# EAGLE schematic etherbotix_revB (EAGLE 7.1.0)
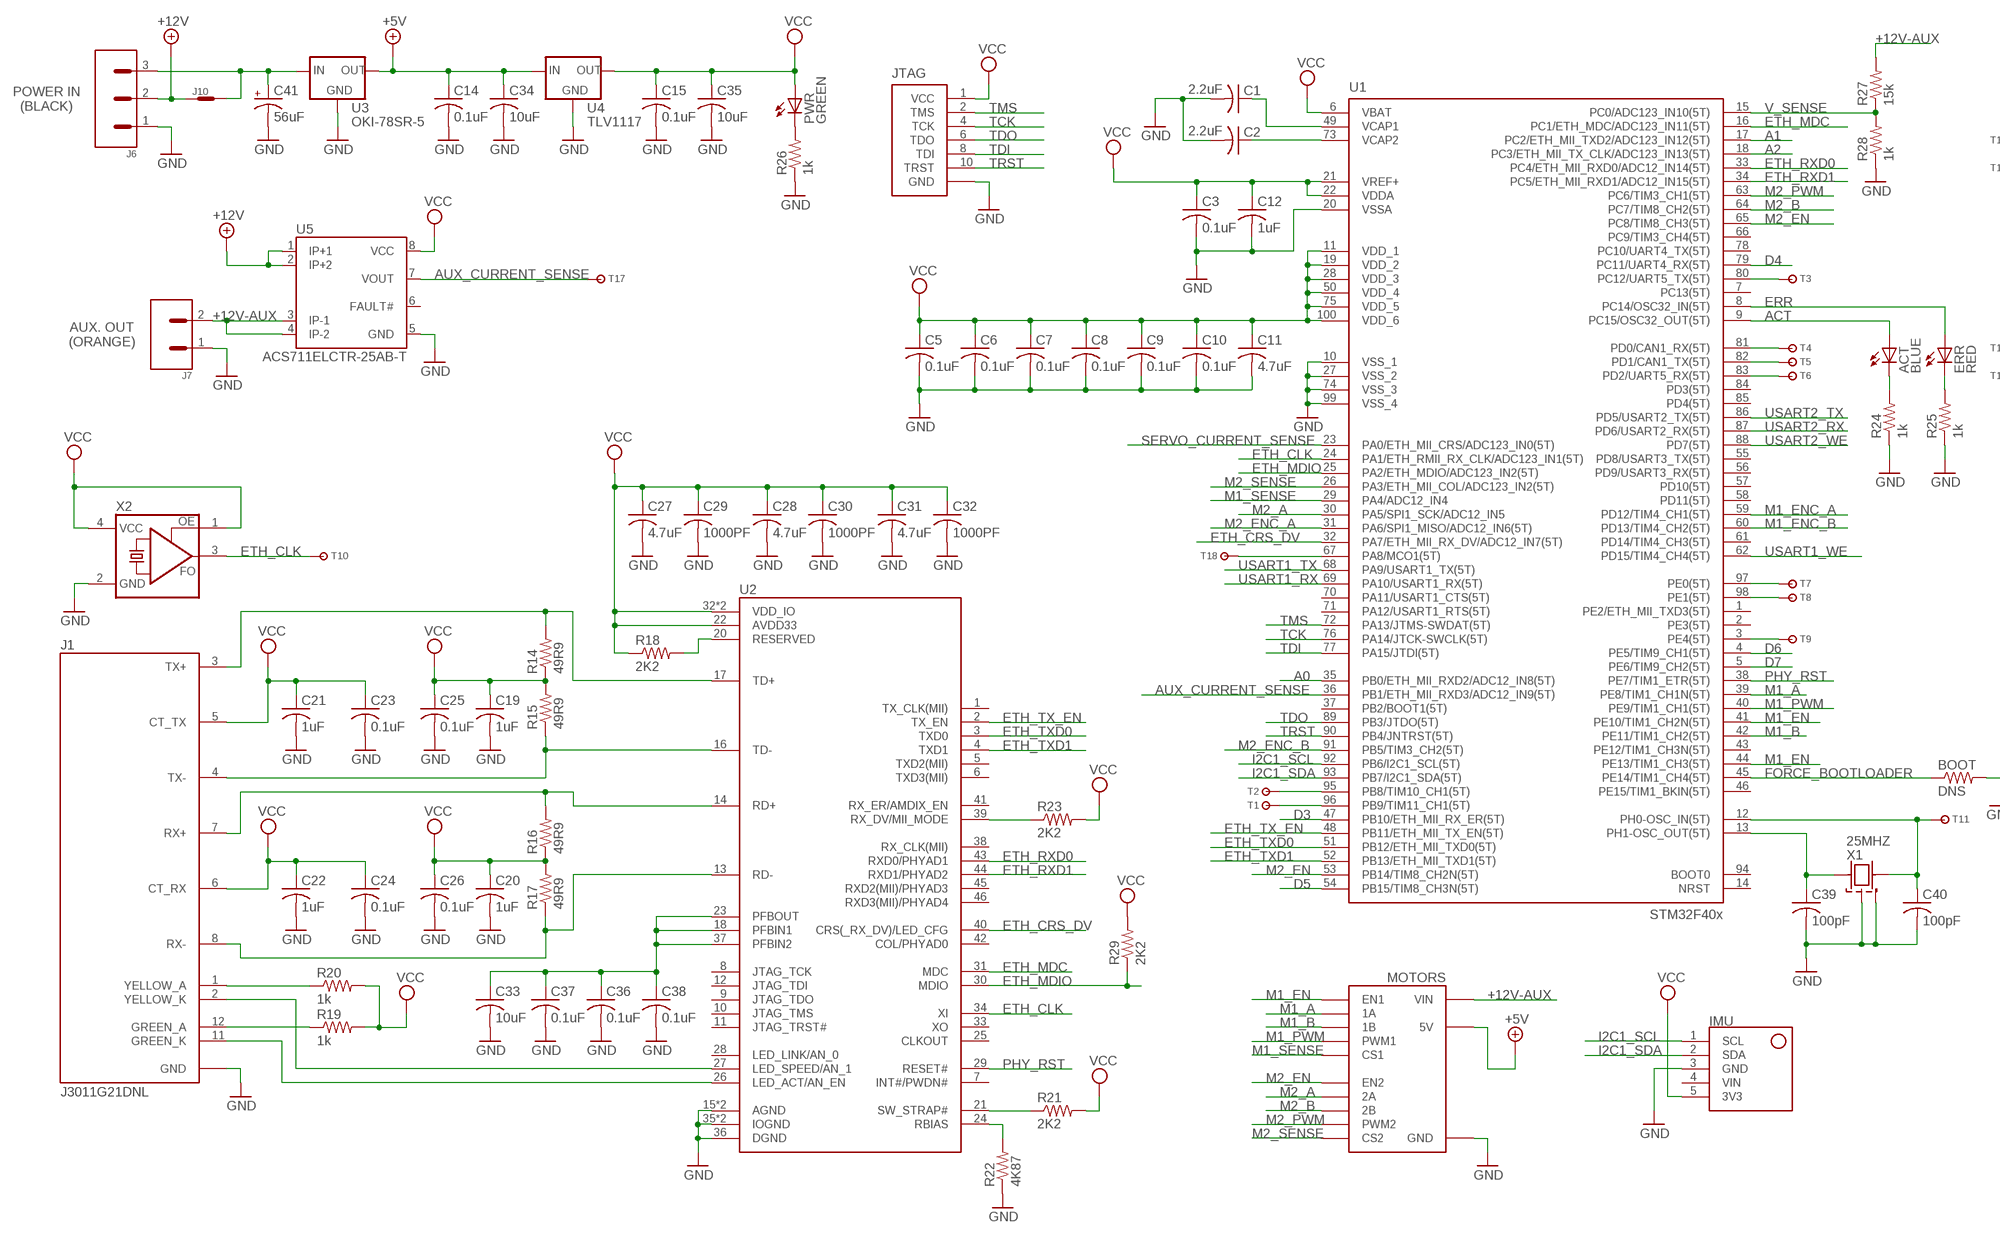
[diagram p0: schematic, sheet 1, part 1 of 2]
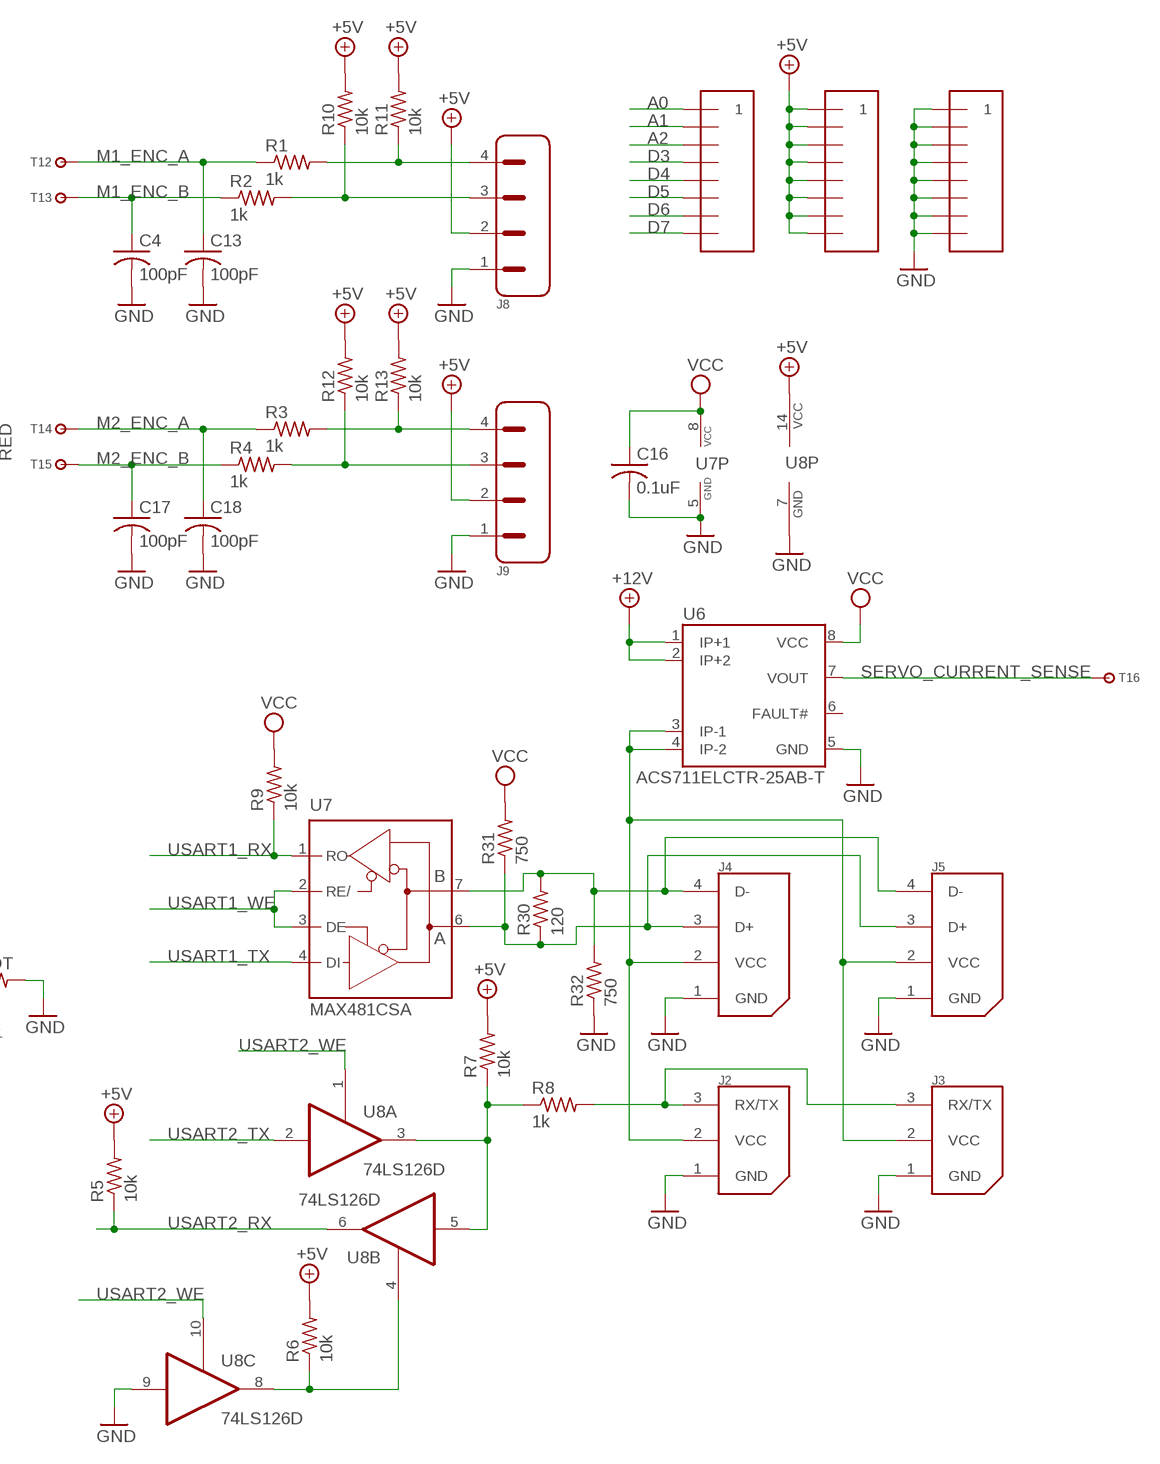
[diagram p1: schematic, sheet 1, part 2 of 2]

## Parts
ACT  BLUE  APT1608SGC  [LED0603]
BOOT  DNS  P1.00KHCT-ND  [0603]
C1  2.2uF  C1608X5R1C225K  [C0603]
C2  2.2uF  C1608X5R1C225K  [C0603]
C3  0.1uF  C1608X7R1H104K  [C0603]
C4  100pF  C1608C0G1H101J  [C0603]
C5  0.1uF  C1608X7R1H104K  [C0603]
C6  0.1uF  C1608X7R1H104K  [C0603]
C7  0.1uF  C1608X7R1H104K  [C0603]
C8  0.1uF  C1608X7R1H104K  [C0603]
C9  0.1uF  C1608X7R1H104K  [C0603]
C10  0.1uF  C1608X7R1H104K  [C0603]
C11  4.7uF  C1608X5R0J475K  [0603]
C12  1uF  C1608X5R1H105M  [C0603]
C13  100pF  C1608C0G1H101J  [C0603]
C14  0.1uF  C1608X7R1H104K  [C0603]
C15  0.1uF  C1608X7R1H104K  [C0603]
C16  0.1uF  C1608X7R1H104K  [C0603]
C17  100pF  C1608C0G1H101J  [C0603]
C18  100pF  C1608C0G1H101J  [C0603]
C19  1uF  C1608X5R1H105M  [C0603]
C20  1uF  C1608X5R1H105M  [C0603]
C21  1uF  C1608X5R1H105M  [C0603]
C22  1uF  C1608X5R1H105M  [C0603]
C23  0.1uF  C1608X7R1H104K  [C0603]
C24  0.1uF  C1608X7R1H104K  [C0603]
C25  0.1uF  C1608X7R1H104K  [C0603]
C26  0.1uF  C1608X7R1H104K  [C0603]
C27  4.7uF  C1608X5R0J475K  [0603]
C28  4.7uF  C1608X5R0J475K  [0603]
C29  1000PF  C1608X7R1H102K  [0603]
C30  1000PF  C1608X7R1H102K  [0603]
C31  4.7uF  C1608X5R0J475K  [0603]
C32  1000PF  C1608X7R1H102K  [0603]
C33  10uF  C1608X5R0J106M  [C0603]
C34  10uF  C1608X5R0J106M  [C0603]
C35  10uF  C1608X5R0J106M  [C0603]
C36  0.1uF  C1608X7R1H104K  [C0603]
C37  0.1uF  C1608X7R1H104K  [C0603]
C38  0.1uF  C1608X7R1H104K  [C0603]
C39  100pF  C1608C0G1H101J  [C0603]
C40  100pF  C1608C0G1H101J  [C0603]
C41  56uF  25SVPF56M  [OSCON_SVPF_6.3MM]
ERR  RED  APT1608SGC  [LED0603]
IMU  MINI9IMU  [MINI9IMU]
J1  J3011G21DNL  [J3]
J2  22-03-5035  [5267-3]
J3  22-03-5035  [5267-3]
J4  22-03-5045  [5267-4]
J5  22-03-5045  [5267-4]
J6  1760520000  [1760520000]
J7  1760490000  [1760490000]
J8  502443-0470  [502443-0470]
J9  502443-0470  [502443-0470]
J10  JUMPER  [J2]
JTAG  CORTEX_DEBUG-SHROUDED  [3220-10-0300-00]
MOTORS  MD03A  [MD03A]
PWR  GREEN  APT1608SGC  [LED0603]
R1  1k  P1.00KHCT-ND  [0603]
R2  1k  P1.00KHCT-ND  [0603]
R3  1k  P1.00KHCT-ND  [0603]
R4  1k  P1.00KHCT-ND  [0603]
R5  10k  P10.0KHCT-ND  [0603]
R6  10k  P10.0KHCT-ND  [0603]
R7  10k  P10.0KHCT-ND  [0603]
R8  1k  P1.00KHCT-ND  [0603]
R9  10k  P10.0KHCT-ND  [0603]
R10  10k  P10.0KHCT-ND  [0603]
R11  10k  P10.0KHCT-ND  [0603]
R12  10k  P10.0KHCT-ND  [0603]
R13  10k  P10.0KHCT-ND  [0603]
R14  49R9  P49.9HCT-ND  [0603]
R15  49R9  P49.9HCT-ND  [0603]
R16  49R9  P49.9HCT-ND  [0603]
R17  49R9  P49.9HCT-ND  [0603]
R18  2K2  P2.20KHCT-ND  [0603]
R19  1k  P1.00KHCT-ND  [0603]
R20  1k  P1.00KHCT-ND  [0603]
R21  2K2  P2.20KHCT-ND  [0603]
R22  4K87  P4.87KHCT-ND  [0603]
R23  2K2  P2.20KHCT-ND  [0603]
R24  1k  P1.00KHCT-ND  [0603]
R25  1k  P1.00KHCT-ND  [0603]
R26  1k  P1.00KHCT-ND  [0603]
R27  15k  P15.0KHCT-ND  [0603]
R28  1k  P1.00KHCT-ND  [0603]
R29  2K2  P2.20KHCT-ND  [0603]
R30  120  P120HCT-ND  [0603]
R31  750  P750HCT-ND  [0603]
R32  750  P750HCT-ND  [0603]
T1  TESTPAD  [TEST]
T2  TESTPAD  [TEST]
T3  TESTPAD  [TEST]
T4  TESTPAD  [TEST]
T5  TESTPAD  [TEST]
T6  TESTPAD  [TEST]
T7  TESTPAD  [TEST]
T8  TESTPAD  [TEST]
T9  TESTPAD  [TEST]
T10  TESTPAD  [TEST]
T11  TESTPAD  [TEST]
T12  TESTPAD  [TEST]
T13  TESTPAD  [TEST]
T14  TESTPAD  [TEST]
T15  TESTPAD  [TEST]
T16  TESTPAD  [TEST]
T17  TESTPAD  [TEST]
T18  TESTPAD  [TEST]
U1  STM32F407V  [TQFP100]
U2  TLK110  [LQFP48]
U3  OKI-78SR-5  OKI-78SR-5/1.5-W36-C  [OKI-78SR]
U4  TLV1117  TLV1117-33IKVURG3KVU  [DPAK]
U5  ACS711ELCTR-25AB-T  [SOIC8]
U6  ACS711ELCTR-25AB-T  [SOIC8]
U7  MAX481CSA  [SO08]
U8  74LS126D  [SO14]
U$1  HEADER8  [1X8]
U$2  HEADER8  [1X8]
U$3  HEADER8  [1X8]
X1  25MHZ  ABM3B-25.000MHZ-B2-T  [4LCC]
X2  ASEMB-50.000MHZ-XY-T  [OSCILLATOR]

## Nets
+5V: C14.1 C34.1 J8.2 J9.2 MOTORS.5V R5.2 R6.2 R7.2 R10.2 R11.2 R12.2 R13.2 U3.P$3(OUT) U4.3(IN) U8.14(P:VCC) U$2.P$1 U$2.P$2 U$2.P$3 U$2.P$4 U$2.P$5 U$2.P$6 U$2.P$7 U$2.P$8
+12V: J6.2 J10.A U5.1(IP+1) U5.2(IP+2) U6.1(IP+1) U6.2(IP+2)
+12V-AUX: J7.2 MOTORS.VIN1(VIN) MOTORS.VIN2(VIN) R27.2 U5.3(IP-1) U5.4(IP-2)
A0: U1.35(PB0/ETH_MII_RXD2/ADC12_IN8(5T)) U$1.P$1
A1: U1.17(PC2/ETH_MII_TXD2/ADC123_IN12(5T)) U$1.P$2
A2: U1.18(PC3/ETH_MII_TX_CLK/ADC123_IN13(5T)) U$1.P$3
ACT: ACT.A U1.9(PC15/OSC32_OUT(5T))
AUX_CURRENT_SENSE: T17.T U1.36(PB1/ETH_MII_RXD3/ADC12_IN9(5T)) U5.7(VOUT)
D3: U1.47(PB10/ETH_MII_RX_ER(5T)) U$1.P$4
D4: U1.79(PC11/UART4_RX(5T)) U$1.P$5
D5: U1.54(PB15/TIM8_CH3N(5T)) U$1.P$6
D6: U1.4(PE5/TIM9_CH1(5T)) U$1.P$7
D7: U1.5(PE6/TIM9_CH2(5T)) U$1.P$8
ERR: ERR.A U1.8(PC14/OSC32_IN(5T))
ETH_CLK: T10.T U1.24(PA1/ETH_RMII_RX_CLK/ADC123_IN1(5T)) U2.34(XI) X2.3(FO)
ETH_CRS_DV: U1.32(PA7/ETH_MII_RX_DV/ADC12_IN7(5T)) U2.40(CRS(_RX_DV)/LED_CFG)
ETH_MDC: U1.16(PC1/ETH_MDC/ADC123_IN11(5T)) U2.31(MDC)
ETH_MDIO: R29.1 U1.25(PA2/ETH_MDIO/ADC123_IN2(5T)) U2.30(MDIO)
ETH_RXD0: U1.33(PC4/ETH_MII_RXD0/ADC12_IN14(5T)) U2.43(RXD0/PHYAD1)
ETH_RXD1: U1.34(PC5/ETH_MII_RXD1/ADC12_IN15(5T)) U2.44(RXD1/PHYAD2)
ETH_TX_EN: U1.48(PB11/ETH_MII_TX_EN(5T)) U2.2(TX_EN)
ETH_TXD0: U1.51(PB12/ETH_MII_TXD0(5T)) U2.3(TXD0)
ETH_TXD1: U1.52(PB13/ETH_MII_TXD1(5T)) U2.4(TXD1)
FORCE_BOOTLOADER: BOOT.1 U1.45(PE14/TIM1_CH4(5T))
GND: BOOT.2 C1.2 C2.2 C3.2 C4.2 C5.2 C6.2 C7.2 C8.2 C9.2 C10.2 C11.2 C12.2 C13.2 C14.2 C15.2 C16.2 C17.2 C18.2 C19.2 C20.2 C21.2 C22.2 C23.2 C24.2 C25.2 C26.2 C27.2 C28.2 C29.2 C30.2 C31.2 C32.2 C33.2 C34.2 C35.2 C36.2 C37.2 C38.2 C39.2 C40.2 C41.- IMU.3(GND) J1.9(GND) J1.10(GND) J1.A(GND) J1.B(GND) J2.1(GND) J3.1(GND) J4.1(GND) J5.1(GND) J6.1 J7.1 J8.1 J9.1 JTAG.3(GND) JTAG.5(GND) JTAG.9(GND) MOTORS.GND1(GND) MOTORS.GND2(GND) R22.1 R24.1 R25.1 R26.1 R28.1 R32.1 U1.10(VSS_1) U1.20(VSSA) U1.27(VSS_2) U1.74(VSS_3) U1.99(VSS_4) U2.15(AGND) U2.19(AGND) U2.35(IOGND) U2.36(DGND) U2.47(IOGND) U3.P$2(GND) U4.1(GND) U5.5(GND) U6.5(GND) U7.5(GND) U8.7(P:GND) U8.9(C:I) U$3.P$1 U$3.P$2 U$3.P$3 U$3.P$4 U$3.P$5 U$3.P$6 U$3.P$7 U$3.P$8 X1.2(G1) X1.4(G2) X2.2(GND)
I2C1_SCL: IMU.1(SCL) U1.92(PB6/I2C1_SCL(5T))
I2C1_SDA: IMU.2(SDA) U1.93(PB7/I2C1_SDA(5T))
M1_A: MOTORS.1A U1.39(PE8/TIM1_CH1N(5T))
M1_B: MOTORS.1B U1.42(PE11/TIM1_CH2(5T))
M1_EN: MOTORS.EN1 U1.41(PE10/TIM1_CH2N(5T)) U1.44(PE13/TIM1_CH3(5T))
M1_ENC_A: C13.1 R1.1 T12.T U1.59(PD12/TIM4_CH1(5T))
M1_ENC_B: C4.1 R2.1 T13.T U1.60(PD13/TIM4_CH2(5T))
M1_PWM: MOTORS.PWM1 U1.40(PE9/TIM1_CH1(5T))
M1_SENSE: MOTORS.CS1 U1.29(PA4/ADC12_IN4)
M2_A: MOTORS.2A U1.30(PA5/SPI1_SCK/ADC12_IN5)
M2_B: MOTORS.2B U1.64(PC7/TIM8_CH2(5T))
M2_EN: MOTORS.EN2 U1.53(PB14/TIM8_CH2N(5T)) U1.65(PC8/TIM8_CH3(5T))
M2_ENC_A: C18.1 R3.1 T14.T U1.31(PA6/SPI1_MISO/ADC12_IN6(5T))
M2_ENC_B: C17.1 R4.1 T15.T U1.91(PB5/TIM3_CH2(5T))
M2_PWM: MOTORS.PWM2 U1.63(PC6/TIM3_CH1(5T))
M2_SENSE: MOTORS.CS2 U1.26(PA3/ETH_MII_COL/ADC123_IN2(5T))
N$1: J1.4(TX-) R15.1 U2.16(TD-)
N$2: J2.2(VCC) J3.2(VCC) J4.2(VCC) J5.2(VCC) U6.3(IP-1) U6.4(IP-2)
N$3: C39.1 U1.13(PH1-OSC_OUT(5T)) X1.1
N$4: C1.1 U1.49(VCAP1)
N$5: C2.1 U1.73(VCAP2)
N$6: J8.3 R2.2 R10.1
N$7: J8.4 R1.2 R11.1
N$8: J9.4 R3.2 R13.1
N$9: J9.3 R4.2 R12.1
N$10: J4.3(D+) J5.3(D+) R30.1 R31.1 U7.6(A)
N$11: J4.4(D-) J5.4(D-) R30.2 R32.2 U7.7(B)
N$12: R7.1 R8.1 U8.3(A:O) U8.5(B:I)
N$13: R6.1 U8.4(B:OE) U8.8(C:O)
N$14: J2.3(RX/TX) J3.3(RX/TX) R8.2
N$15: C40.1 T11.T U1.12(PH0-OSC_IN(5T)) X1.3
N$16: J1.3(TX+) R14.2 U2.17(TD+)
N$17: R18.2 U2.20(RESERVED)
N$18: J1.2(YELLOW_K) U2.27(LED_SPEED/AN_1)
N$19: J1.7(RX+) R16.2 U2.14(RD+)
N$20: J1.11(GREEN_K) U2.26(LED_ACT/AN_EN)
N$21: J1.8(RX-) R17.1 U2.13(RD-)
N$22: J1.1(YELLOW_A) R20.1
N$23: J1.12(GREEN_A) R19.1
N$24: C33.1 C36.1 C37.1 C38.1 U2.18(PFBIN1) U2.23(PFBOUT) U2.37(PFBIN2)
N$25: R21.1 U2.21(SW_STRAP#)
N$26: R22.2 U2.24(RBIAS)
N$27: R23.1 U2.39(RX_DV/MII_MODE)
N$28: PWR.C R26.2
N$29: C41.+ J6.3 J10.B U3.P$1(IN)
N$30: ERR.C R25.2
N$31: ACT.C R24.2
PA8: T18.T U1.67(PA8/MCO1(5T))
PB8: T2.T U1.95(PB8/TIM10_CH1(5T))
PB9: T1.T U1.96(PB9/TIM11_CH1(5T))
PC12: T3.T U1.80(PC12/UART5_TX(5T))
PD0: T4.T U1.81(PD0/CAN1_RX(5T))
PD1: T5.T U1.82(PD1/CAN1_TX(5T))
PD2: T6.T U1.83(PD2/UART5_RX(5T))
PE0: T7.T U1.97(PE0(5T))
PE1: T8.T U1.98(PE1(5T))
PE4: T9.T U1.3(PE4(5T))
PHY_RST: U1.38(PE7/TIM1_ETR(5T)) U2.29(RESET#)
SERVO_CURRENT_SENSE: T16.T U1.23(PA0/ETH_MII_CRS/ADC123_IN0(5T)) U6.7(VOUT)
TCK: JTAG.4(TCK) U1.76(PA14/JTCK-SWCLK(5T))
TDI: JTAG.8(TDI) U1.77(PA15/JTDI(5T))
TDO: JTAG.6(TDO) U1.89(PB3/JTDO(5T))
TMS: JTAG.2(TMS) U1.72(PA13/JTMS-SWDAT(5T))
TRST: JTAG.10(TRST) U1.90(PB4/JNTRST(5T))
USART1_RX: R9.1 U1.69(PA10/USART1_RX(5T)) U7.1(RO)
USART1_TX: U1.68(PA9/USART1_TX(5T)) U7.4(DI)
USART1_WE: U1.62(PD15/TIM4_CH4(5T)) U7.2(RE/) U7.3(DE)
USART2_RX: R5.1 U1.87(PD6/USART2_RX(5T)) U8.6(B:O)
USART2_TX: U1.86(PD5/USART2_TX(5T)) U8.2(A:I)
USART2_WE: U1.88(PD7(5T)) U8.1(A:OE) U8.10(C:OE)
V_SENSE: R27.1 R28.2 U1.15(PC0/ADC123_IN10(5T))
VCC: C3.1 C5.1 C6.1 C7.1 C8.1 C9.1 C10.1 C11.1 C12.1 C15.1 C16.1 C19.1 C20.1 C21.1 C22.1 C23.1 C24.1 C25.1 C26.1 C27.1 C28.1 C29.1 C30.1 C31.1 C32.1 C35.1 IMU.5(3V3) J1.5(CT_TX) J1.6(CT_RX) JTAG.1(VCC) PWR.A R9.2 R14.1 R15.2 R16.1 R17.2 R18.1 R19.2 R20.2 R21.2 R23.2 R29.2 R31.2 U1.6(VBAT) U1.11(VDD_1) U1.19(VDD_2) U1.21(VREF+) U1.22(VDDA) U1.28(VDD_3) U1.50(VDD_4) U1.75(VDD_5) U1.100(VDD_6) U2.22(AVDD33) U2.32(VDD_IO) U2.48(VDD_IO) U4.4(OUT) U5.8(VCC) U6.8(VCC) U7.8(VCC) X2.1(OE) X2.4(VCC)
Unconnected: IMU.4(VIN) U1.1(PE2/ETH_MII_TXD3(5T)) U1.2(PE3(5T)) U1.7(PC13(5T)) U1.14(NRST) U1.37(PB2/BOOT1(5T)) U1.43(PE12/TIM1_CH3N(5T)) U1.46(PE15/TIM1_BKIN(5T)) U1.55(PD8/USART3_TX(5T)) U1.56(PD9/USART3_RX(5T)) U1.57(PD10(5T)) U1.58(PD11(5T)) U1.61(PD14/TIM4_CH3(5T)) U1.66(PC9/TIM3_CH4(5T)) U1.70(PA11/USART1_CTS(5T)) U1.71(PA12/USART1_RTS(5T)) U1.78(PC10/UART4_TX(5T)) U1.84(PD3(5T)) U1.85(PD4(5T)) U1.94(BOOT0) U2.1(TX_CLK(MII)) U2.5(TXD2(MII)) U2.6(TXD3(MII)) U2.7(INT#/PWDN#) U2.8(JTAG_TCK) U2.9(JTAG_TDO) U2.10(JTAG_TMS) U2.11(JTAG_TRST#) U2.12(JTAG_TDI) U2.25(CLKOUT) U2.28(LED_LINK/AN_0) U2.33(XO) U2.38(RX_CLK(MII)) U2.41(RX_ER/AMDIX_EN) U2.42(COL/PHYAD0) U2.45(RXD2(MII)/PHYAD3) U2.46(RXD3(MII)/PHYAD4) U5.6(FAULT#) U6.6(FAULT#) U8.11(D:O) U8.12(D:I) U8.13(D:OE)

## Notes on the sheet
- POWER IN
  (BLACK)
- AUX. OUT
  (ORANGE)

## Library data of the parts
ACT ERR PWR = fergs:APT1608SGC: LED 568NM GREEN CLR 0603 SMD
BOOT = fergs:P1.00KHCT-ND: (C5) RES 1.00K OHM 1/10W 1% 0603 SMD; VALUE: 1k
C1 C2 = fergs:C1608X5R1C225K: (A10) CAP CER 2.2UF 16V 10% X5R 0603
C3 C5-C10 C14-C16 C23-C26 C36-C38 = fergs:C1608X7R1H104K: (A7) CAP CER 0.1UF 50V 10% X7R 0603
C4 C13 C17 C18 C39 C40 = fergs:C1608C0G1H101J: (A3) CAP CER 100PF 50V 5% NP0 0603
C11 C27 C28 C31 = fergs:C1608X5R0J475K: (A13) CAP CER 4.7UF 6.3V 10% X5R
C12 C19-C22 = fergs:C1608X5R1H105M: (A9) 1uF 50V 20% X5R 0603
C29 C30 C32 = fergs:C1608X7R1H102K: (A4) CAP CER 1000PF 50V 10% X7R 0603
C33-C35 = fergs:C1608X5R0J106M: (A14) CAP CER 10UF 6.3V 20% X5R 0603
C41 = fergs:25SVPF56M: CAP POLYMER 56UF 25V 20% SMD; RIPPLE: 2.8A
IMU = pololu:MINI9IMU: Pololu Mini-IMU v2
J1 = ethernet:J3011G21DNL: CONN MAGJACK 1PORT 100 BASE-TX tested: YES (etherbotix)
J2 J3 = molex:22-03-5035: Molex SPOX Vert, Tin (Dynamixel AX/MX Bus) tested: YES (arbotix)
J4 J5 = molex:22-03-5045: Molex SPOX Vert, Tin (Dynamixel RX Bus) tested: YES (arbotix2)
J6 = headers:1760520000: 15A 3P TERM BLOCK, BLACK tested: NO
J7 = headers:1760490000: 15A 2P TERM BLOCK, ORANGE tested: NO
J8 J9 = molex:502443-0470: CONN RCPT VERT 4POS 2.00MM PCB tested: YES (etherbotix)
J10 = headers:JUMPER
JTAG = headers:CORTEX_DEBUG: CONN HEADER 10POS DL UNSHRD SMD tested: YES (etherbotix)
MOTORS = pololu:MD03A: Pololu MD03A Motor Driver
R1-R4 R8 R19 R20 R24-R26 R28 = fergs:P1.00KHCT-ND: (C5) RES 1.00K OHM 1/10W 1% 0603 SMD
R5-R7 R9-R13 = fergs:P10.0KHCT-ND: (C10) RES 10.0K OHM 1/10W 1% 0603 SMD
R14-R17 = fergs:P49.9HCT-ND: (C3) RES 49.9 OHM 1/10W 1% 0603 SMD
R18 R21 R23 R29 = fergs:P2.20KHCT-ND: (C7) RES 2.2K OHM 1/10W 1% 0603 SMD
R22 = fergs:P4.87KHCT-ND: RES 4.87K OHM 1/10W 1% 0603 SMD
R27 = fergs:P15.0KHCT-ND: (C11) RES 15.0K OHM 1/10W 1% 0603 SMD
R30 = fergs:P120HCT-ND: RES 120 OHM 1/10W 1% 0603 SMD
R31 R32 = fergs:P750HCT-ND: RES 750 OHM 1/10W 1% 0603 SMD
T1-T18 = fergs:TESTPAD
U1 = stm32f4:STM32F407V: STM32F407 100 pin LQFP tested: YES (etherbotix)
U2 = ethernet:TLK110: IC ETHERNET PHY 10/100 48LQFP tested: NO
U3 = power:OKI-78SR*-W36-C: CONV DC/DC 36VIN tested: YES (etherbotix); VOLTAGE: 5
U4 = power:TLV1117-33IKVURG3: IC REG LDO 3.3V 0.8A TO252-3 tested: YES (etherbotix)
U5 U6 = allegro:ACS711E: SENSOR CURRENT 3.3V 8-SOIC tested: YES (etherbotix); CURRENT: 25A
U7 = maxim:MAX481CSA: RS485 TRANSEIVER; MF: MAXIM; MPN: MAX481CSA; OC_FARNELL: unknown; OC_NEWARK: 90C3817
U8 = 74xx-us:74*126: Quad bus BUFFER, 3-state
U$1-U$3 = headers:HEADER8
X1 = stm32f4:ABM3B-*MHZ-B2-T: CRYSTAL, SMD tested: YES (etherbotix); FREQ: 25.000; LOAD_CAPACITANCE: 18pF
X2 = ethernet:ASEMB-50.000MHZ-XY-T: OSC MEMS 50.000MHZ CMOS SMD